# Altium project LoRa.PrjPcb
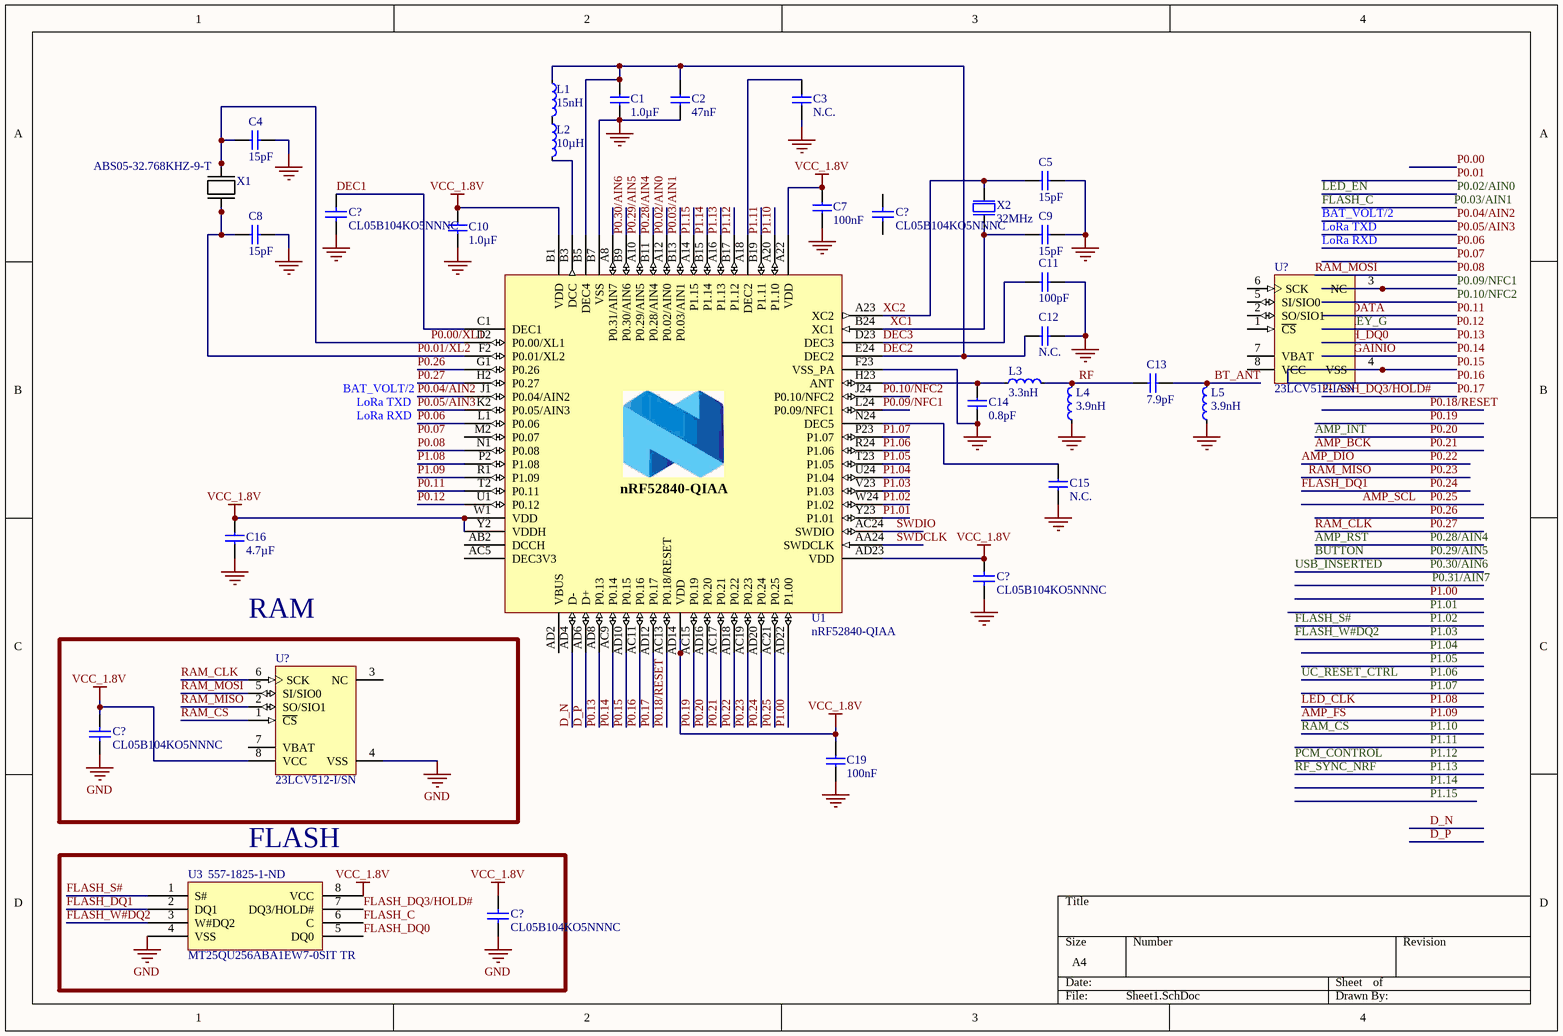
[diagram p0: Sheet1.SchDoc]
2 sheets, 48 parts. Net scope: global (net labels, ports and power ports of the same name join across sheets).
Board file: PCB1.PcbDoc
Sheets:
  Sheet1.SchDoc
  Sheet2.SchDoc

## Sheet Sheet1.SchDoc
size A4

### Parts
(Parts that share a designator on the sheet are numbered #1, #2 ... from top to bottom, then left to right.)
C1  1.0µF  [CAPC1005X04L]
C2  47nF  [CAPC1005X04L]
C3  N.C.  [CAPC1005X04L]
C4  15pF  [CAPC1005X04L]
C5  15pF  [CAPC1005X04L]
C7  100nF  [CAPC1005X04L]
C8  15pF  [CAPC1005X04L]
C9  15pF  [CAPC1005X04L]
C10  1.0µF  [CAPC1005X04L]
C11  100pF  [CAPC1005X04L]
C12  N.C.  [CAPC1005X04L]
C13  7.9pF  [CAPC1005X04L]
C14  0.8pF  [CAPC1005X04L]
C15  N.C.  [CAPC1005X04L]
C16  4.7µF  [CAPC1005X04L]
C19  100nF  [CAPC1005X04L]
C?#1  CL05B104KO5NNNC  [CAPC1050X55X23ML05T13]
C?#2  CL05B104KO5NNNC  [CAPC1050X55X23ML05T13]
C?#3  CL05B104KO5NNNC  [CAPC1050X55X23ML05T13]
C?#4  CL05B104KO5NNNC  [CAPC1050X55X23ML05T13]
C?#5  CL05B104KO5NNNC  [CAPC1050X55X23ML05T13]
L1  15nH  [INDC1005X04L]
L2  10µH  [INDC1608X06L]
L3  3.3nH  [INDC1005X04L]
L4  3.9nH  [INDC1005X04L]
L5  3.9nH  [INDC1005X04L]
U1  nRF52840-QIAA  [AQFN50P700X700X85_HS-74N]
U3  MT25QU256ABA1EW7-0SIT TR  Supplier Part Number 1: 557-1825-1-ND  [MT25QU256ABA1EW7-0SIT TR]
U?#1  23LCV512-I/SN  [MCHP-SOIC-SN8_N]
U?#2  23LCV512-I/SN  [MCHP-SOIC-SN8_N]
X1  ABS05-32.768KHZ-9-T  [ABS05-32.768KHZ-9-T]
X2  32MHz  [BT-XTAL_2016]

### Blocks framed on the sheet
RAM: C?#4 U?#2
FLASH: C?#5 U3

### Nets
GND: C1.1 C2.1 C3.2 C4.1 C5.2 C7.2 C8.1 C9.2 C10.2 C11.2 C12.1 C14.1 C15.2 C16.2 C19.2 C?#1.2 C?#3.2 C?#4.2 C?#5.2 L4.1 L5.1 U1.74(GND) U1.B7(VSS) U1.F23(VSS_PA) U3.4(VSS) U?#2.4(VSS) X2.2(GND) X2.4(GND)
VCC_1.8V: C7.1 C10.1 C16.1 C19.1 C?#3.1 C?#4.1 C?#5.1 U1.A22(VDD) U1.AD14(VDD) U1.AD23(VDD) U1.B1(VDD) U1.W1(VDD) U1.Y2(VDDH) U3.8(VCC) U?#2.8(VCC)
AMP_BCK: U1.AC17(P0.21)  [also labelled P0.21]
AMP_DIO: U1.AD18(P0.22)  [also labelled P0.22]
AMP_FS: U1.R1(P1.09)  [also labelled P1.09]
AMP_GAINIO: U1.AC9(P0.14)  [also labelled P0.14]
AMP_INT: U1.AD16(P0.20)  [also labelled P0.20]
AMP_RST: U1.B11(P0.28/AIN4)  [also labelled P0.28/AIN4]
AMP_SCL: U1.AC21(P0.25)  [also labelled P0.25]
BAT_VOLT/2: U1.J1(P0.04/AIN2)  [also labelled P0.04/AIN2]
BT_ANT: C13.1 L5.2
BUTTON: U1.A10(P0.29/AIN5)  [also labelled P0.29/AIN5]
D_N: U1.AD4(D-)
D_P: U1.AD6(D+)
DEC1: C?#1.1 U1.C1(DEC1)
DEC2: C1.2 C2.2 C12.2 L1.1 U1.B5(DEC4) U1.E24(DEC2)
DEC3: C11.1 U1.D23(DEC3)
FLASH_C: U1.B13(P0.03/AIN1) U3.6(C)  [also labelled P0.03/AIN1]
FLASH_DQ0: U1.AD8(P0.13) U3.5(DQ0)  [also labelled P0.13]
FLASH_DQ1: U1.AD20(P0.24) U3.2(DQ1)  [also labelled P0.24]
FLASH_DQ3/HOLD#: U1.AD12(P0.17) U3.7(DQ3/HOLD#)  [also labelled P0.17]
FLASH_S#: U1.W24(P1.02) U3.1(S#)  [also labelled P1.02]
FLASH_W#DQ2: U1.V23(P1.03) U3.3(W#DQ2)  [also labelled P1.03]
LED_CLK: U1.P2(P1.08)  [also labelled P1.08]
LED_DATA: U1.T2(P0.11)  [also labelled P0.11]
LED_EN: U1.A12(P0.02/AIN0)  [also labelled P0.02/AIN0]
LoRa RXD: U1.L1(P0.06)  [also labelled P0.06]
LoRa TXD: U1.K2(P0.05/AIN3)  [also labelled P0.05/AIN3]
P0.00/XL1: C4.2 U1.D2(P0.00/XL1) X1.2
P0.01/XL2: C8.2 U1.F2(P0.01/XL2) X1.1
P0.08: U1.N1(P0.08) U?#2.5(SI/SIO0)  [also labelled RAM_MOSI]
P0.09/NFC1: U1.L24(P0.09/NFC1) U?#1.3(NC)
P0.10/NFC2: U1.J24(P0.10/NFC2)
P0.12: U1.U1(P0.12)  [also labelled PWRKEY_G]
P0.15: U1.AC11(P0.16) U1.AD10(P0.15) U?#1.4(VSS)  [also labelled P0.16]
P0.18/RESET: U1.AC13(P0.18/RESET)
P0.19: U1.AC15(P0.19)
P0.23: U1.AC19(P0.23) U?#2.2(SO/SIO1)  [also labelled RAM_MISO]
P0.26: U1.G1(P0.26)
P0.27: U1.H2(P0.27) U?#2.6(SCK)  [also labelled RAM_CLK]
P0.30/AIN6: U1.B9(P0.30/AIN6)  [also labelled USB_INSERTED]
P1.00: U1.AD22(P1.00)
P1.01: U1.Y23(P1.01)
P1.04: U1.U24(P1.04)
P1.05: U1.T23(P1.05)
P1.06: U1.R24(P1.06)  [also labelled UC_RESET_CTRL]
P1.07: U1.P23(P1.07)
P1.10: U1.A20(P1.10) U?#2.1(~{CS})  [also labelled RAM_CS]
P1.11: U1.B19(P1.11)
P1.12: U1.B17(P1.12)  [also labelled PCM_CONTROL]
P1.13: U1.A16(P1.13)  [also labelled RF_SYNC_NRF]
P1.14: U1.B15(P1.14)
P1.15: U1.A14(P1.15)
RF: C13.2 L3.2 L4.2
SWDCLK: U1.AA24(SWDCLK)
SWDIO: U1.AC24(SWDIO)
XC1: C9.1 U1.B24(XC1) X2.1(inp)
XC2: C5.1 U1.A23(XC2) X2.3(out)
NetC3_1: C3.1 U1.A18(DEC2)
NetC14_2: C14.2 L3.1 U1.H23(ANT)
NetC15_1: C15.1 U1.N24(DEC5)
NetL1_2: L1.2 L2.1
NetL2_2: L2.2 U1.B3(DCC)

Not connected (* = marked no-connect by the designer): C?#2 1 2; U1 A8(P0.31/AIN7) AB2(DCCH) AC5(DEC3V3) AD2(VBUS) M2(P0.07); U?#1 1(~{CS}) 2(SO/SIO1) 5(SI/SIO0) 6(SCK) 7(VBAT) 8(VCC); U?#2 3(NC) 7(VBAT)

### Notes on the sheet
- Labels drawn without touching a wire or pin: BAT_VOLT/2, LoRa RXD, LoRa TXD, P0.07

### Library data of the parts
C1 C10 = C0603-1µ0: CAP 0402; Part number IPS: 00000000616; Note: 16V; Artikkelnr Noca: 20039335; Artikkelnr Simpro: N.A.; Part Number: C0603-1µ0; Manufacturer: *; Manufacturer Part Number: *; Datasheet: *; LatestRevisionDate: 2013-06-05; Pin Count: 2; Publisher: Nordic Semiconductor; Published: 2009-05-08; Value: 1.0µF; Supplier: *; Supplier part number: *; 2nd source Supplier: *; 2nd source part number: *; Footprint Doc: 0603
C2 = C0603-1µ0: CAP 0402; Part number IPS: 00000000616; Value: 1.0µF; Note: 16V; Artikkelnr Noca: 20039335; Artikkelnr Simpro: N.A.; Part Number: C0603-1µ0; Manufacturer: *; Manufacturer Part Number: *; Datasheet: *; LatestRevisionDate: 2013-06-05; Pin Count: 2; Publisher: Nordic Semiconductor; Published: 2009-05-08; Supplier: *; Supplier part number: *; 2nd source Supplier: *; 2nd source part number: *; Footprint Doc: 0603
C3 C12 C15 = C0402-N.C.: CAP 0402 (not mounted); Note: Chip Cap; Artikkelnr Noca: N.A.; Assembly: Not mounted; Part Number: C0402-N.C.; Manufacturer: *; Manufacturer Part Number: *; Datasheet: *; LatestRevisionDate: 2009-05-08; Pin Count: 2; Publisher: Nordic Semiconductor; Published: 2009-05-08; Value: N.C.; Supplier: *; Supplier part number: *; 2nd source Supplier: *; 2nd source part number: *; Footprint Doc: 0402; Artikkelnr Simpro: N.A.
C4 C5 C8 C9 = C0402-12p: CAP 0402; Part number IPS: 00000002398; Value: 12pF; Note: 50V; Artikkelnr Noca: 20029159; Artikkelnr Simpro: N.A.; Part Number: C0402-12p; Manufacturer: *; Manufacturer Part Number: *; Datasheet: *; LatestRevisionDate: 2011-05-11; Pin Count: 2; Publisher: Nordic Semiconductor; Published: 2009-05-08; Supplier: *; Supplier part number: *; 2nd source Supplier: *; 2nd source part number: *; Footprint Doc: 0402
C7 C19 = C0402-100n: CAP 0402; Part number IPS: 00000005296; Note: 16V; Artikkelnr Noca: 20039200; Artikkelnr Simpro: N.A.; Part Number: C0402-100n; Manufacturer: *; Manufacturer Part Number: *; Datasheet: *; LatestRevisionDate: 2009-11-23; Pin Count: 2; Publisher: Nordic Semiconductor; Published: 2009-05-08; Value: 100nF; Supplier: *; Supplier part number: *; 2nd source Supplier: *; 2nd source part number: *; Footprint Doc: 0402
C11 = C0402-100p: CAP 0402; Part number IPS: 00000002361; Note: 50V; Artikkelnr Noca: 20029135; Artikkelnr Simpro: N.A.; Part Number: C0402-100p; Manufacturer: *; Manufacturer Part Number: *; Datasheet: *; LatestRevisionDate: 2009-05-08; Pin Count: 2; Publisher: Nordic Semiconductor; Published: 2009-05-08; Value: 100pF; Supplier: *; Supplier part number: *; 2nd source Supplier: *; 2nd source part number: *; Footprint Doc: 0402
C13 = C0402-0.5p: CAP 0402; Value: 0.5pF; Note: Chip Cap 1%; Artikkelnr Noca: 20020007; Artikkelnr Simpro: N.A.; Part Number: C0402-0.5p; Manufacturer: *; Manufacturer Part Number: *; Datasheet: *; LatestRevisionDate: 2009-05-08; Pin Count: 2; Publisher: Nordic Semiconductor; Published: 2009-05-08; Supplier: *; Supplier part number: *; 2nd source Supplier: *; 2nd source part number: *; Footprint Doc: 0402
C14 = C0402-0.8p: CAP 0402; Note: 50V; Artikkelnr Noca: 20029147; Artikkelnr Simpro: N.A.; Part Number: C0402-0.8p; Manufacturer: *; Manufacturer Part Number: *; Datasheet: *; LatestRevisionDate: 2012-11-21; Pin Count: 2; Publisher: Nordic Semiconductor; Published: 2009-05-08; Value: 0.8pF; Supplier: *; Supplier part number: *; 2nd source Supplier: *; 2nd source part number: *; Footprint Doc: 0402
C16 = C0603-4µ7-6.3V-X7R: CAP 0402; Manufacturer: Samsung; Manufacturer Part Number: CL10B475KQ8NQNC; Note: 6.3V; Artikkelnr Noca: 20039473; Artikkelnr Simpro: N.A.; Part Number: C0603-4µ7-6.3V-X7R; Datasheet: http://media.digikey.com/pdf/Data%20Sheets/Samsung%20PDFs/CL10B475KQ8NQNC_Spec.pdf; LatestRevisionDate: 2015-06-10; Pin Count: 2; Publisher: Nordic Semiconductor; Published: 2015-06-10; Value: 4.7µF; Supplier: Digi-Key; Supplier part number: 1276-2087-1-ND; 2nd source Supplier: *; 2nd source part number: *; Footprint Doc: 0603
C?#1-C?#5 = CMP-2000-05439-1: Chip Capacitor, 100 nF, +/- 10%, 16 V, -55 to 125 degC, 0402 (1005 Metric), RoHS, Tape and Reel; Manufacturer: Samsung Electro-Mechanics; Capacitance: 100000pF; Dielectric: X7R; Rated Voltage: 16V; Case Size/Dimension: 0402; Tolerance (%): ±10%; Manufacturer URL: http://www.samsungsem.com/global/index.jsp; Datasheet URL: https://datasheet.ciiva.com/29198/458718-da-01-en-vs-kondensator-0402-29198423.pdf; Datasheet Version: Nov-10
L1 = L0402-15n: Inductor, 0402; Manufacturer: Taiyo Yuden; Manufacturer Part Number: HK100515NJ-T; 2nd source part number: 658-1328; Note: High frequency chip inductor ±10%; Artikkelnr Noca: 33029323; Artikkelnr Simpro: N.A.; Part Number: L0402-15n; LatestRevisionDate: 2012-09-19; Pin Count: 2; Publisher: Nordic Semiconductor; Published: 2010-07-12; Value: 15nH; Supplier: Digi-Key; Datasheet: http://www.yuden.co.jp/productdata/catalog/en/mlci04_e.pdf; Supplier part number: 587-1521-1-ND; 2nd source Supplier: Farnell; Footprint Doc: 0402
L2 = L0603-10µ: Inductor, 0603; Manufacturer: Taiyo Yuden; Manufacturer Part Number: LBMF1608T100K; 2nd source part number: 178-6105; Note: LBMF1608T100K 10µH 80mA 0603; Artikkelnr Noca: 33029314; Artikkelnr Simpro: N.A.; Part Number: L0603-10µ; Datasheet: http://www.yuden.co.jp/ut/product/pdf/elb2_e.pdf; LatestRevisionDate: 2012-09-19; Pin Count: 2; Publisher: Nordic Semiconductor; Published: 2010-02-24; Value: 10µH; Supplier: Digi-Key; Supplier part number: 587-1714-1-ND; 2nd source Supplier: Farnell; Footprint Doc: 0603
L3 = L0402-3n3: Inductor, 0402; Manufacturer: Murata; Manufacturer Part Number: LQP15MN3N3B02D; Note: High frequency chip inductor ±5%; Artikkelnr Noca: 33029369; Artikkelnr Simpro: N.A.; Part Number: L0402-3n3; Datasheet: http://search.murata.co.jp/Ceramy/image/img/PDF/ENG/L0075S0084LQP15M.pdf; LatestRevisionDate: 2012-09-19; Pin Count: 2; Publisher: Nordic Semiconductor; Published: 2009-05-08; Value: 3.3nH; Supplier: Digi-Key; Supplier part number: 490-1130-1-ND; 2nd source Supplier: *; 2nd source part number: *; Footprint Doc: 0402
L4 L5 = L0402-3n3: Inductor, 0402; Manufacturer: Murata; Manufacturer Part Number: LQP15MN3N3B02D; Value: 3.3nH; Note: High frequency chip inductor ±5%; Artikkelnr Noca: 33029369; Artikkelnr Simpro: N.A.; Part Number: L0402-3n3; Datasheet: http://search.murata.co.jp/Ceramy/image/img/PDF/ENG/L0075S0084LQP15M.pdf; LatestRevisionDate: 2012-09-19; Pin Count: 2; Publisher: Nordic Semiconductor; Published: 2009-05-08; Supplier: Digi-Key; Supplier part number: 490-1130-1-ND; 2nd source Supplier: *; 2nd source part number: *; Footprint Doc: 0402
U1 = nRF52840-QIAAAA: Multi-protocol Bluetooth Low Energy, ANT and 2.4GHz proprietary system-on-chip; Manufacturer: Nordic Semiconductor; Artikkelnr Noca: 15079344; Artikkelnr Simpro: N.A.; Part Number: nRF52840-QIAAAA; Manufacturer Part Number: nRF52840-QIAAAA; Datasheet: *; LatestRevisionDate: 2016-06-28; Pin Count: 73; Publisher: Nordic Semiconductor; Published: 2016-06-22; Value: nRF52840-QIAA; Note: *; Supplier: Nordic Semiconductor; Supplier part number: nRF52840-QIAAAA; 2nd source Supplier: *; 2nd source part number: *; Footprint Doc: AQFN-73
U3 = MT25QU256ABA1EW7-0SIT TR: FLASH (MT25QU256ABA1EW7-0SIT TR); Supplier 1: Digi-Key
U?#1 U?#2 = CMP-0163-00042-1: 512K bits SPI Serial SRAM with Battery Backup and SDI Interface, 2.5 to 5.5 V, 20 MHz, -40 to 85 degC, 8-pin SOIC (SN8), Tube; Manufacturer: Microchip; ComponentLink3Description: Package Specification; PackageReference: SOIC-SN8; PartNumber: 23LCV512-I/SN; PackageVersion: C04-057C; DatasheetVersion: Rev. A; ComponentLink3URL: http://www.microchip.com/stellent/groups/techpub_sg/documents/packagingspec/en012702.pdf; ComponentLink4URL: http://www.microchip.com/23LCV512; ComponentLink1Description: Manufacturer URL; ComponentLink1URL: http://www.microchip.com; Mounting Technology: Surface Mount; PackageDescription: 8-Lead Plastic Small Outline, 4.9 x 3.9 mm Body, 1.27 mm Pitch; ComponentLink4Description: Product URL; ComponentLink2URL: http://ww1.microchip.com/downloads/en/DeviceDoc/25157A.pdf; ComponentLink2Description: Datasheet
X1 = ABS05-32.768KHZ-9-T: Crystal (ABS05-32.768KHZ-9-T)
X2 = XTAL_SMD2016_32MHz_8pF_Epson: XTAL SMD 2016, 32MHz, Cl=8pF, Total Tol: ±40ppm; Manufacturer: Epson Toyocom; Manufacturer Part Number: Q22FA12800025; Note: XTAL SMD 32.000MHz; Artikkelnr Noca: N.A.; Part Number: XTAL_SMD2016_32MHz_8pF_Epson; Datasheet: http://www.epsondevice.com/docs/qd/en/DownloadServlet?id=ID000449; LatestRevisionDate: 2014-11-27; Pin Count: 4; Publisher: Nordic Semiconductor; Published: 2012-03-09; Value: 32MHz; Supplier: Farnell; Supplier part number: 171-2806; 2nd source Supplier: *; 2nd source part number: *; Footprint Doc: XTAL_2016; Artikkelnr Simpro: N.A.

## Sheet Sheet2.SchDoc
size A4
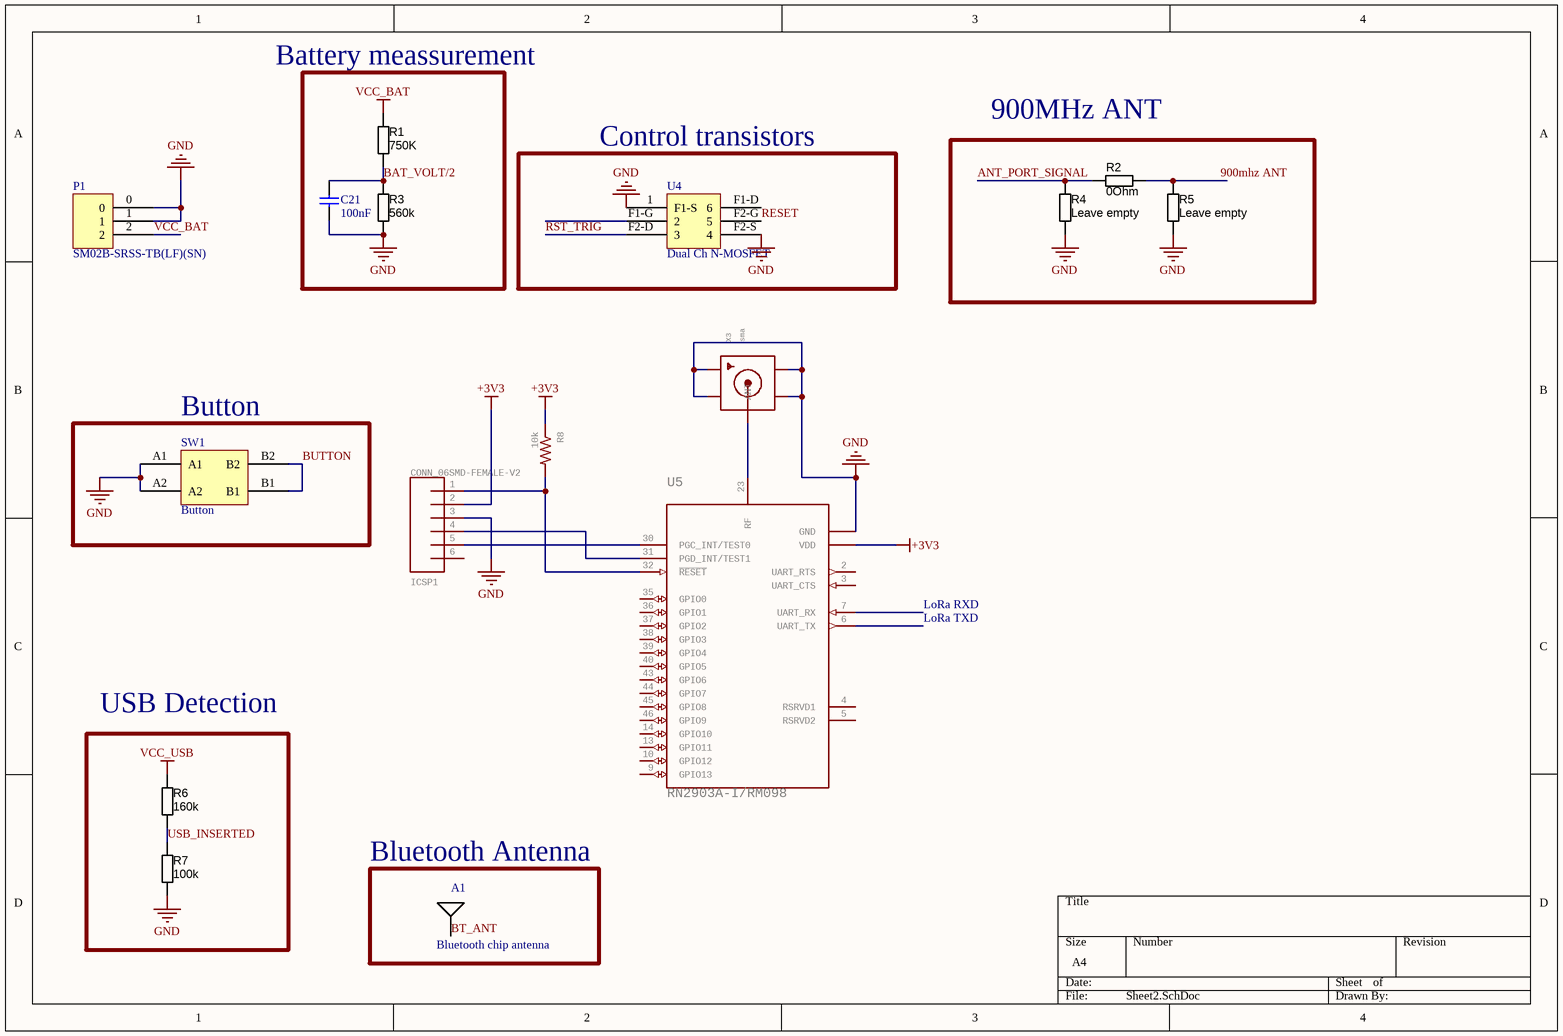
[diagram p1: Sheet2.SchDoc]

### Parts
A1  Bluetooth chip antenna  [2450AT18A100E]
C21  100nF  [CAPC1005X04L]
ICSP1  CONN_06SMD-FEMALE-V2  [1X06-SMD-FEMALE]
P1  SM02B-SRSS-TB(LF)(SN)  [BM02B-SRSS-TB]
R1  value 750K  [RESC1005N]  (hidden comment: 750K 1%)
R2  0Ohm  [RESC1005N]
R3  value 560k  [RESC1005N]  (hidden comment: 560K 1%)
R4  value Leave empty  [RESC1005N]  (hidden comment: not mounted)
R5  value Leave empty  [RESC1005N]  (hidden comment: not mounted)
R6  160k  [RESC1005N]
R7  100k  [RESC1005N]
R8  10k  [R0603]
SW1  Button  [EVQ-Q2K02W]
U4  Dual Ch N-MOSFET  [FC6946010R]
U5  RN2903A-I/RM098  [XCVR_RN2903A-I/RM098]
X3  sma  [SMA_EDGELAUNCH]

### Blocks framed on the sheet
Control transistors: U4
900MHz ANT: R2 R4 R5
Button: SW1
USB Detection: R6 R7
Bluetooth Antenna: A1

### Nets
+3V3: ICSP1.2 R8.1 U5.12_34(VDD)
GND: C21.2 ICSP1.3 P1.0 P1.1 R3.1 R4.1 R5.1 R7.1 SW1.A1 SW1.A2 U4.1(F1-S) U4.F2-S(4) U5.1_8_11_20_21_22_24_26_27_28_33_41_47(GND) X3.GND@1(GND4) X3.GND@2(GND3) X3.GND@3(GND2) X3.GND@4(GND1)
VCC_BAT: P1.2 R1.2
VCC_USB: R6.2
900mhz ANT: R2.2 R5.2
ANT_PORT_SIGNAL: R2.1 R4.2
BAT_VOLT/2: C21.1 R1.1 R3.2
BT_ANT: A1.Feed
BUTTON: SW1.B1 SW1.B2
RESET: U4.F2-G(5)
RST_TRIG: U4.F2-D(3)
USB_INSERTED: R6.1 R7.2  [project net P0.30/AIN6]
NetICSP1_1: ICSP1.1 R8.2 U5.32(~{RESET})
NetICSP1_4: ICSP1.4 U5.31(PGD_INT/TEST1)
NetICSP1_5: ICSP1.5 U5.30(PGC_INT/TEST0)
NetU5_23: U5.23(RF) X3.P(ANT)

Not connected (* = marked no-connect by the designer): ICSP1 6; U4 F1-D(6) F1-G(2); U5 2(UART_RTS) 3(UART_CTS) 4(RSRVD1) 5(RSRVD2) 6(UART_TX) 7(UART_RX) 9(GPIO13) 10(GPIO12) 13(GPIO11) 14(GPIO10) 35(GPIO0) 36(GPIO1) 37(GPIO2) 38(GPIO3) 39(GPIO4) 40(GPIO5) 43(GPIO6) 44(GPIO7) 45(GPIO8) 46(GPIO9)

### Notes on the sheet
- Battery meassurement
- LoRa RXD
- LoRa TXD

### Library data of the parts
A1 = 2450AT18A100E: Antenna (2450AT18A100E)
C21 = C0402-100n: Generic 10%, X7R, 0402, Capacitor; Note: 16V; Artikkelnr Noca: 20039200; Artikkelnr Simpro: N.A.; Part Number: C0402-100n; Manufacturer: *; Manufacturer Part Number: *; Datasheet: *; LatestRevisionDate: 2009-11-23; Pin Count: 2; Publisher: Nordic Semiconductor; Published: 2009-05-08; Value: 100nF; Supplier: *; Supplier part number: *; 2nd source Supplier: *; 2nd source part number: *; Footprint Doc: 0402
ICSP1 = CONN_06SMD-FEMALE-V2: Multi connection point. Often used as Generic Header-pin footprint for 0.1 inch spaced/style header connections    On any of the 0.1 inch spaced packages, you can populate with these:  Break Away Headers - Straight (PRT-00116)   Break Away Male Headers - Right Angle (PRT-00553)   Female Headers (PRT-00115)   Break Away Headers - Machine Pin (PRT-00117)   Break Away Female Headers - Swiss Machine Pin (PRT-00743)   Arduino Stackable Header - 6 Pin (PRT-09280)        For SCREWTERMINALS and SPRING TERMINALS visit here:  Screw Terimnals on SparkFun.com (5mm/3.5mm/2.54mm spacing)       This device is also useful as a general connection point to wire up your design to another part of your project. Our various solder wires solder well into these plated through hole pads.  Hook-Up Wire - Assortment (Stranded, 22 AWG) (PRT-11375)   Hook-Up Wire - Assortment (Solid Core, 22 AWG) (PRT-11367)   View the entire wire category on our website here; GateName_1: G$1; PROD_ID: CONN-09668; SymbolName_1: CONN_06; DeviceName: SMD-FEMALE-V2; LibraryName: SparkFun-Connectors; DeviceSetName: CONN_06
R1 R3 = RES_2K2_0402_5%: Generic 1% 0402 resistor; Manufacturer 1: Vishay Dale; Manufacturer Part Number 1: CRCW04022K20JNED; Ratings: 1/16 W; Tolerance: ±5%; Package / Case: 0402 (1005 metric); Material: Thick Film; Manufacturer 2: Yageo; Manufacturer Part Number 2: RC0402JR-072K2L; Supplier 1: Digi-Key; Supplier Part Number 1: 541-2.2KJCT-ND; ComponentLink1URL: http://www.vishay.com/doc?20035; ComponentLink1Description: http://www.vishay.com/doc?20035; Supplier 2: Digi-Key; Supplier Part Number 2: 311-2.2KJRCT-ND; ComponentLink2URL: http://www.yageo.com/documents/recent/PYu-RC0402_51_RoHS_L_6.pdf; ComponentLink2Description: http://www.yageo.com/documents/recent/PYu-RC0402_51_RoHS_L_6.pdf
R2 = RES_2K2_0402_5%: Resistor SMD  0402; Manufacturer 1: Vishay Dale; Manufacturer Part Number 1: CRCW04022K20JNED; Ratings: 1/16 W; Tolerance: ±5%; Package / Case: 0402 (1005 metric); Material: Thick Film; Manufacturer 2: Yageo; Manufacturer Part Number 2: RC0402JR-072K2L; Supplier 1: Digi-Key; Supplier Part Number 1: 541-2.2KJCT-ND; ComponentLink1URL: http://www.vishay.com/doc?20035; ComponentLink1Description: http://www.vishay.com/doc?20035; Supplier 2: Digi-Key; Supplier Part Number 2: 311-2.2KJRCT-ND; ComponentLink2URL: http://www.yageo.com/documents/recent/PYu-RC0402_51_RoHS_L_6.pdf; ComponentLink2Description: http://www.yageo.com/documents/recent/PYu-RC0402_51_RoHS_L_6.pdf; Value: 0Ohm
R4 = RES_2K2_0402_5%: Resistor SMD 0402 (not mounted); Manufacturer 1: Vishay Dale; Manufacturer Part Number 1: CRCW04022K20JNED; Ratings: 1/16 W; Tolerance: ±5%; Package / Case: 0402 (1005 metric); Material: Thick Film; Manufacturer 2: Yageo; Manufacturer Part Number 2: RC0402JR-072K2L; Supplier 1: Digi-Key; Supplier Part Number 1: 541-2.2KJCT-ND; ComponentLink1URL: http://www.vishay.com/doc?20035; ComponentLink1Description: http://www.vishay.com/doc?20035; Supplier 2: Digi-Key; Supplier Part Number 2: 311-2.2KJRCT-ND; ComponentLink2URL: http://www.yageo.com/documents/recent/PYu-RC0402_51_RoHS_L_6.pdf; ComponentLink2Description: http://www.yageo.com/documents/recent/PYu-RC0402_51_RoHS_L_6.pdf
R5 = RES_2K2_0402_5%: Resistor SMD  0402 (not mounted); Manufacturer 1: Vishay Dale; Manufacturer Part Number 1: CRCW04022K20JNED; Ratings: 1/16 W; Tolerance: ±5%; Package / Case: 0402 (1005 metric); Material: Thick Film; Manufacturer 2: Yageo; Manufacturer Part Number 2: RC0402JR-072K2L; Supplier 1: Digi-Key; Supplier Part Number 1: 541-2.2KJCT-ND; ComponentLink1URL: http://www.vishay.com/doc?20035; ComponentLink1Description: http://www.vishay.com/doc?20035; Supplier 2: Digi-Key; Supplier Part Number 2: 311-2.2KJRCT-ND; ComponentLink2URL: http://www.yageo.com/documents/recent/PYu-RC0402_51_RoHS_L_6.pdf; ComponentLink2Description: http://www.yageo.com/documents/recent/PYu-RC0402_51_RoHS_L_6.pdf
R6 R7 = RES_2K2_0402_5%: Generic 5% 0402 resistor; Manufacturer 1: Vishay Dale; Manufacturer Part Number 1: CRCW04022K20JNED; Ratings: 1/16 W; Package / Case: 0402 (1005 metric); Tolerance: ±5%; Material: Thick Film; Manufacturer 2: Yageo; Manufacturer Part Number 2: RC0402JR-072K2L; Supplier 1: Digi-Key; Supplier Part Number 1: 541-2.2KJCT-ND; ComponentLink1URL: http://www.vishay.com/doc?20035; ComponentLink1Description: http://www.vishay.com/doc?20035; Supplier 2: Digi-Key; Supplier Part Number 2: 311-2.2KJRCT-ND; ComponentLink2URL: http://www.yageo.com/documents/recent/PYu-RC0402_51_RoHS_L_6.pdf; ComponentLink2Description: http://www.yageo.com/documents/recent/PYu-RC0402_51_RoHS_L_6.pdf
  R6: Value: 160k
  R7: Value: 100k
R8 = R-US_R0603: RESISTOR, American symbol; GateName_1: G$1; SymbolName_1: R-US; DeviceSetName: R-US_; DeviceName: R0603; LibraryName: resistor
SW1 = EVQ-Q2K02W: EVQ-Q2K03W
U4 = FC6946010R
U5 = RN2903A-I/RM098: 300kbps 18.5 dBm LoRa (Low Power Long Range) 915 MHz Transceiver Module; GateName_1: G$1; MF: Microchip; SymbolName_1: RN2903A-I/RM098; LibraryName: bitsetters; DeviceSetName: RN2903A-I/RM098; AVAILABILITY: Bad; MP: RN2903A-I/RM098; PACKAGE: Module Microchip; PRICE: 12.18 USD
X3 = SMACONNECTOR_EDGE: SMA Connector   90Â° DIP SMA Connector, 50 Ohm (4UConnector: 07259); GateName_1: G$1; DeviceName: _EDGE; SymbolName_1: SMACONNECTOR; LibraryName: adafruit; DeviceSetName: SMACONNECTOR

## Nets that join several sheets
GND: Sheet1 (28 pins), Sheet2 (17 pins)
BAT_VOLT/2: Sheet1 (U1.J1), Sheet2 (C21.1 R1.1 R3.2)
BT_ANT: Sheet1 (C13.1 L5.2), Sheet2 (A1.Feed)
BUTTON: Sheet1 (U1.A10), Sheet2 (SW1.B1 SW1.B2)
P0.30/AIN6: Sheet1 (U1.B9), Sheet2 (R6.1 R7.2)